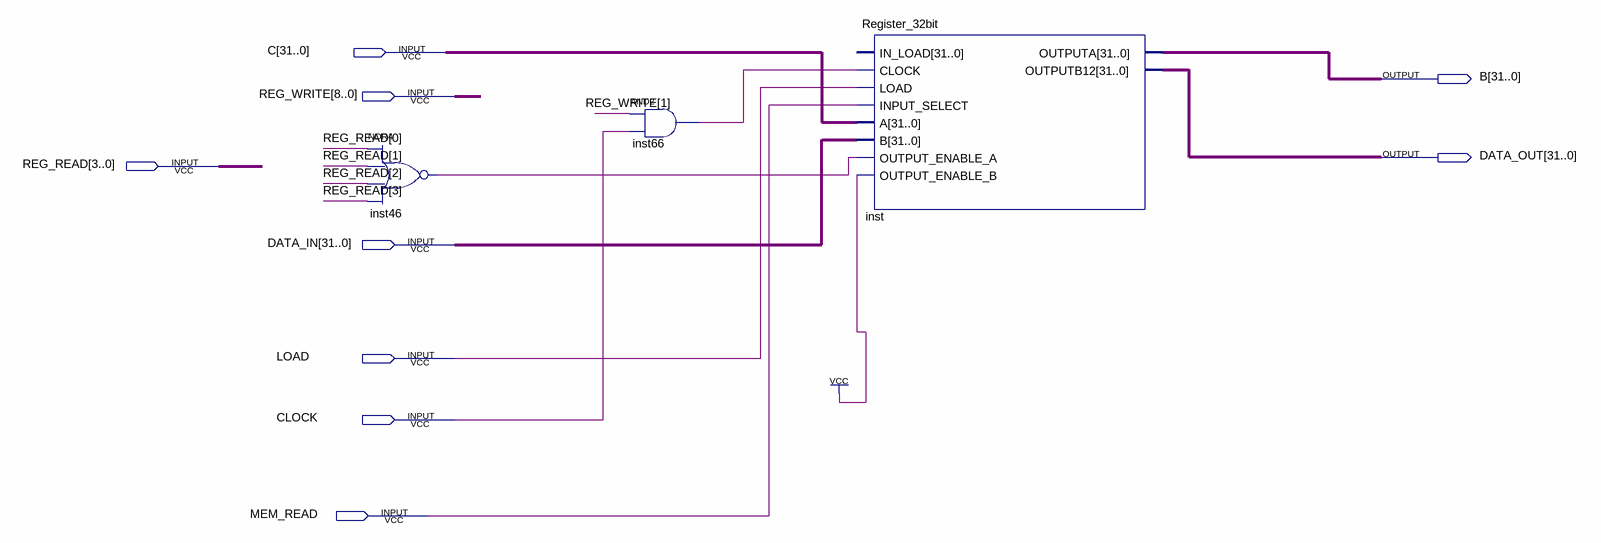
[diagram p0: schematic sheet]
// Quartus schematic MDR.bdf as structural Verilog: 3 symbols, 9 pins
module MDR (
  input  [31:0] C,
  input  [8:0] REG_WRITE,
  input  [3:0] REG_READ,
  input  [31:0] DATA_IN,
  input  LOAD,
  input  CLOCK,
  input  MEM_READ,
  output [31:0] B,
  output [31:0] DATA_OUT
);

  wire inst46_out, inst66_out;

  nor inst46 (inst46_out, REG_READ[0], REG_READ[1], REG_READ[2], REG_READ[3]);
  and inst66 (inst66_out, REG_WRITE[1], CLOCK);
  Register_32bit inst (
    .CLOCK(inst66_out), .LOAD(LOAD), .INPUT_SELECT(MEM_READ), .A(C), .B(DATA_IN),
    .OUTPUT_ENABLE_A(inst46_out), .OUTPUT_ENABLE_B(1'b1), .OUTPUTA(B), .OUTPUTB12(DATA_OUT));  // open: IN_LOAD
endmodule
